# EAGLE design 130801_AriloRX_0_0 (EAGLE 6.1)
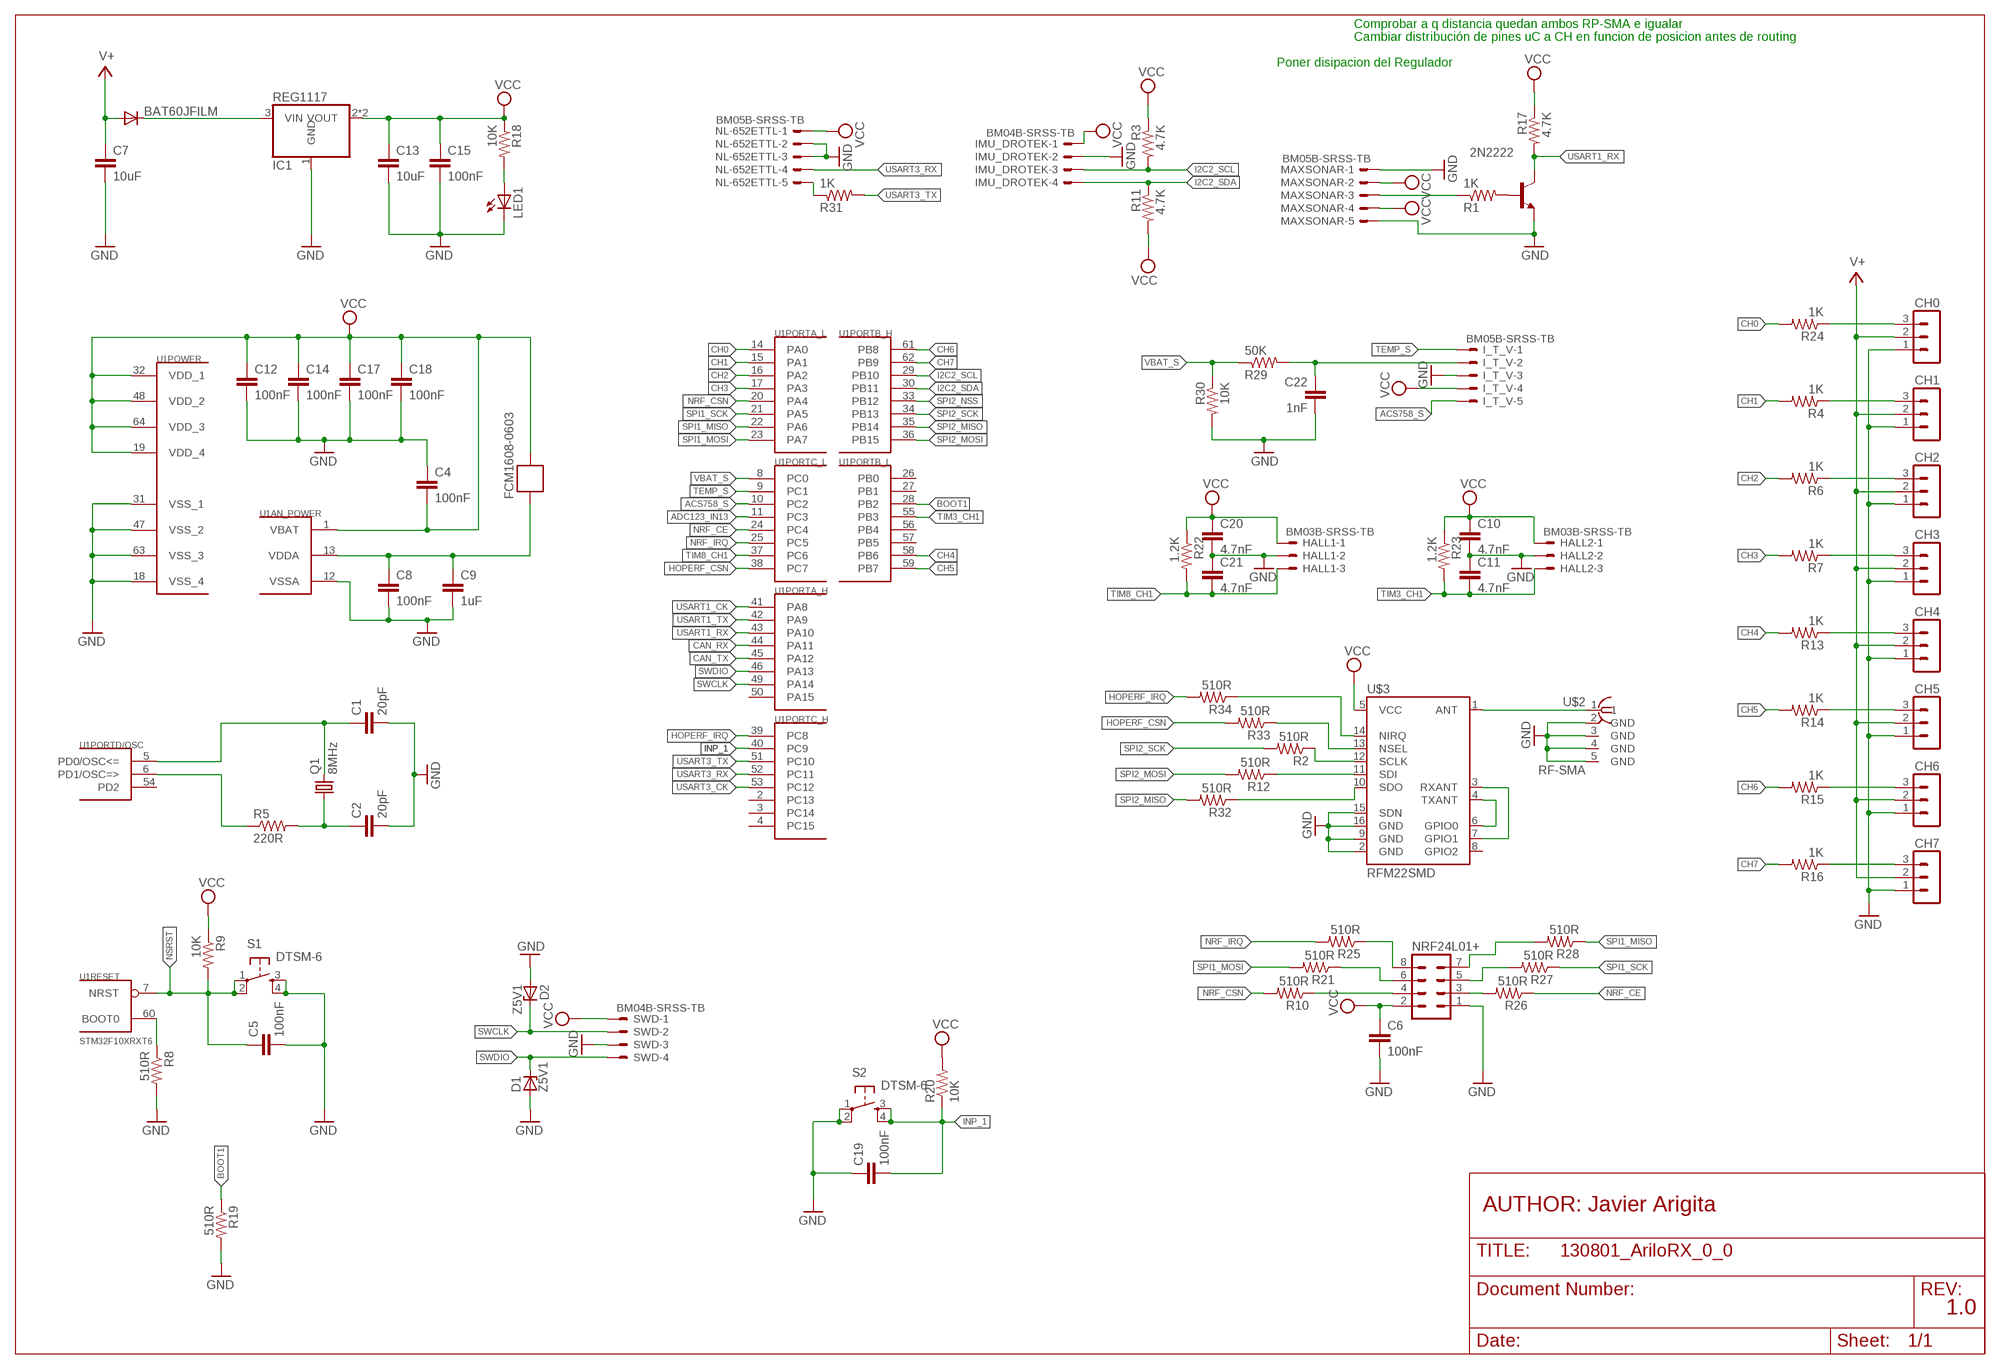
[diagram p0: schematic, sheet 1]

## Parts
2N2222  MMBT2222ALT1-NPN-SOT23-BEC  [SOT23-BEC]
BAT60JFILM  DIODE-SOD323-R  [SOD323-R]
C1  20pF  C-EUC0805  [C0805]
C2  20pF  C-EUC0805  [C0805]
C4  100nF  C-EUC0805  [C0805]
C5  100nF  C-EUC0805  [C0805]
C6  100nF  C-EUC0805  [C0805]
C7  10uF  C-EUC3216  [C3216]
C8  100nF  C-EUC0805  [C0805]
C9  1uF  C-EUC3216  [C3216]
C10  4.7nF  C-EUC0805  [C0805]
C11  4.7nF  C-EUC0805  [C0805]
C12  100nF  C-EUC0805  [C0805]
C13  10uF  C-EUC3216  [C3216]
C14  100nF  C-EUC0805  [C0805]
C15  100nF  C-EUC0805  [C0805]
C17  100nF  C-EUC0805  [C0805]
C18  100nF  C-EUC0805  [C0805]
C19  100nF  C-EUC0805  [C0805]
C20  4.7nF  C-EUC0805  [C0805]
C21  4.7nF  C-EUC0805  [C0805]
C22  1nF  C-EUC0805  [C0805]
CH0  MA03-1  [MA03-1]
CH1  MA03-1  [MA03-1]
CH2  MA03-1  [MA03-1]
CH3  MA03-1  [MA03-1]
CH4  MA03-1  [MA03-1]
CH5  MA03-1  [MA03-1]
CH6  MA03-1  [MA03-1]
CH7  MA03-1  [MA03-1]
D1  Z5V1  ZENER-DIODESOD80C  [SOD80C]
D2  Z5V1  ZENER-DIODESOD80C  [SOD80C]
FCM1608-0603  FERRITE-BEAD  [R0603]
HALL1  BM03B-SRSS-TB  [BM03B-SRSS-TB]
HALL2  BM03B-SRSS-TB  [BM03B-SRSS-TB]
I_T_V  BM05B-SRSS-TB  [BM05B-SRSS-TB]
IC1  REG1117  [SOT223]
IMU_DROTEK  BM04B-SRSS-TB  [BM04B-SRSS-TB]
LED1  LED0805  [CHIPLED_0805]
MAXSONAR  BM05B-SRSS-TB  [BM05B-SRSS-TB]
NL-652ETTL  BM05B-SRSS-TB  [BM05B-SRSS-TB]
NRF24L01+  MA04-2  [MA04-2]
Q1  8MHz  CRYSTALSM49  [SM49]
R1  1K  RESISTOR0805  [R0805]
R2  510R  RESISTOR0805  [R0805]
R3  4.7K  RESISTOR0805  [R0805]
R4  1K  RESISTOR0805  [R0805]
R5  220R  RESISTOR0805  [R0805]
R6  1K  RESISTOR0805  [R0805]
R7  1K  RESISTOR0805  [R0805]
R8  510R  RESISTOR0805  [R0805]
R9  10K  RESISTOR0805  [R0805]
R10  510R  RESISTOR0805  [R0805]
R11  4.7K  RESISTOR0805  [R0805]
R12  510R  RESISTOR0805  [R0805]
R13  1K  RESISTOR0805  [R0805]
R14  1K  RESISTOR0805  [R0805]
R15  1K  RESISTOR0805  [R0805]
R16  1K  RESISTOR0805  [R0805]
R17  4.7K  RESISTOR0805  [R0805]
R18  10K  RESISTOR0805  [R0805]
R19  510R  RESISTOR0805  [R0805]
R20  10K  RESISTOR0805  [R0805]
R21  510R  RESISTOR0805  [R0805]
R22  1.2K  RESISTOR0805  [R0805]
R23  1.2K  RESISTOR0805  [R0805]
R24  1K  RESISTOR0805  [R0805]
R25  510R  RESISTOR0805  [R0805]
R26  510R  RESISTOR0805  [R0805]
R27  510R  RESISTOR0805  [R0805]
R28  510R  RESISTOR0805  [R0805]
R29  50K  RESISTOR0805  [R0805]
R30  10K  RESISTOR0805  [R0805]
R31  1K  RESISTOR0805  [R0805]
R32  510R  RESISTOR0805  [R0805]
R33  510R  RESISTOR0805  [R0805]
R34  510R  RESISTOR0805  [R0805]
S1  DTSM-6  [DTSM-6]
S2  DTSM-6  [DTSM-6]
SWD  BM04B-SRSS-TB  [BM04B-SRSS-TB]
U1  STM32F10XRXT6  [TQFP64]
U$2  RF-SMA  [BU-SMA-H]
U$3  RFM22SMD  [RFM22-XXX-S2]

## Nets
ACS758_S: I_T_V.5 U1.10(PORTC_L:PC2)
ADC123_IN13: U1.11(PORTC_L:PC3)
BOOT1: R19.1 U1.28(PORTB_L:PB2)
CAN_RX: U1.44(PORTA_H:PA11)
CAN_TX: U1.45(PORTA_H:PA12)
CH0: R24.2 U1.14(PORTA_L:PA0)
CH1: R4.2 U1.15(PORTA_L:PA1)
CH2: R6.2 U1.16(PORTA_L:PA2)
CH3: R7.2 U1.17(PORTA_L:PA3)
CH4: R13.2 U1.58(PORTB_L:PB6)
CH5: R14.2 U1.59(PORTB_L:PB7)
CH6: R15.2 U1.61(PORTB_H:PB8)
CH7: R16.2 U1.62(PORTB_H:PB9)
GND: 2N2222.E C1.2 C2.2 C4.1 C5.2 C6.2 C7.2 C8.2 C9.2 C10.2 C11.1 C12.2 C13.2 C14.2 C15.2 C17.2 C18.2 C19.1 C20.2 C21.1 C22.2 CH0.1 CH1.1 CH2.1 CH3.1 CH4.1 CH5.1 CH6.1 CH7.1 D1.A D2.A HALL1.2 HALL2.2 I_T_V.3 IC1.1(GND) IMU_DROTEK.2 LED1.C MAXSONAR.1 MAXSONAR.5 NL-652ETTL.2 NL-652ETTL.3 NRF24L01+.1 R8.2 R19.2 R30.2 S1.3 S1.4 S2.1 S2.2 SWD.3 U1.12(AN_POWER:VSSA) U1.18(POWER:VSS_4) U1.31(POWER:VSS_1) U1.47(POWER:VSS_2) U1.63(POWER:VSS_3) U$2.2(GND) U$2.3(GND) U$2.4(GND) U$2.5(GND) U$3.2(GND) U$3.9(GND) U$3.15(SDN) U$3.16(GND)
HOPERF_CSN: R33.2 U1.38(PORTC_L:PC7)
HOPERF_IRQ: R34.2 U1.39(PORTC_H:PC8)
I2C2_SCL: IMU_DROTEK.3 R3.2 U1.29(PORTB_H:PB10)
I2C2_SDA: IMU_DROTEK.4 R11.1 U1.30(PORTB_H:PB11)
INP_1: C19.2 R20.1 S2.3 S2.4 U1.40(PORTC_H:PC9)
N$1: C1.1 Q1.2 U1.5(PORTD/OSC:PD0/OSC<=)
N$2: R5.1 U1.6(PORTD/OSC:PD1/OSC=>)
N$3: C2.1 Q1.1 R5.2
N$4: R8.1 U1.60(RESET:BOOT0)
N$5: U$3.3(RXANT) U$3.7(GPIO1)
N$6: U$3.4(TXANT) U$3.6(GPIO0)
N$7: R2.1 U$3.12(SCLK)
N$8: R12.1 U$3.11(SDI)
N$9: CH0.3 R24.1
N$10: LED1.A R18.2
N$11: NL-652ETTL.5 R31.1
N$12: R32.1 U$3.10(SDO)
N$13: BAT60JFILM.C IC1.3(VIN)
N$14: MAXSONAR.3 R1.1
N$15: C22.1 I_T_V.2 R29.2
N$16: 2N2222.B R1.2
N$17: C8.1 C9.1 FCM1608-0603.2 U1.13(AN_POWER:VDDA)
N$18: NRF24L01+.4 R10.1
N$19: NRF24L01+.3 R26.2
N$20: U$2.1 U$3.1(ANT)
N$21: CH2.3 R6.1
N$22: R34.1 U$3.14(NIRQ)
N$23: CH4.3 R13.1
N$24: R33.1 U$3.13(NSEL)
N$31: CH3.3 R7.1
N$32: CH6.3 R15.1
N$34: CH5.3 R14.1
N$35: CH7.3 R16.1
N$36: NRF24L01+.5 R27.2
N$38: NRF24L01+.6 R21.1
N$39: NRF24L01+.8 R25.1
N$42: NRF24L01+.7 R28.2
N$53: CH1.3 R4.1
NRF_CE: R26.1 U1.24(PORTC_L:PC4)
NRF_CSN: R10.2 U1.20(PORTA_L:PA4)
NRF_IRQ: R25.2 U1.25(PORTC_L:PC5)
NSRST: C5.1 R9.2 S1.1 S1.2 U1.7(RESET:NRST)
SPI1_MISO: R28.1 U1.22(PORTA_L:PA6)
SPI1_MOSI: R21.2 U1.23(PORTA_L:PA7)
SPI1_SCK: R27.1 U1.21(PORTA_L:PA5)
SPI2_MISO: R32.2 U1.35(PORTB_H:PB14)
SPI2_MOSI: R12.2 U1.36(PORTB_H:PB15)
SPI2_NSS: U1.33(PORTB_H:PB12)
SPI2_SCK: R2.2 U1.34(PORTB_H:PB13)
SWCLK: D2.C SWD.2 U1.49(PORTA_H:PA14)
SWDIO: D1.C SWD.4 U1.46(PORTA_H:PA13)
TEMP_S: I_T_V.1 U1.9(PORTC_L:PC1)
TIM3_CH1: C11.2 HALL2.3 R23.2 U1.55(PORTB_L:PB3)
TIM8_CH1: C21.2 HALL1.3 R22.2 U1.37(PORTC_L:PC6)
USART1_CK: U1.41(PORTA_H:PA8)
USART1_RX: 2N2222.C R17.2 U1.43(PORTA_H:PA10)
USART1_TX: U1.42(PORTA_H:PA9)
USART3_CK: U1.53(PORTC_H:PC12)
USART3_RX: NL-652ETTL.4 U1.52(PORTC_H:PC11)
USART3_TX: R31.2 U1.51(PORTC_H:PC10)
V+: BAT60JFILM.A C7.1 CH0.2 CH1.2 CH2.2 CH3.2 CH4.2 CH5.2 CH6.2 CH7.2
VBAT_S: R29.1 R30.1 U1.8(PORTC_L:PC0)
VCC: C4.2 C6.1 C10.1 C12.1 C13.1 C14.1 C15.1 C17.1 C18.1 C20.1 FCM1608-0603.1 HALL1.1 HALL2.1 I_T_V.4 IC1.2(VOUT) IC1.4(VOUT) IMU_DROTEK.1 MAXSONAR.2 MAXSONAR.4 NL-652ETTL.1 NRF24L01+.2 R3.1 R9.1 R11.2 R17.1 R18.1 R20.2 R22.1 R23.1 SWD.1 U1.1(AN_POWER:VBAT) U1.19(POWER:VDD_4) U1.32(POWER:VDD_1) U1.48(POWER:VDD_2) U1.64(POWER:VDD_3) U$3.5(VCC)
Unconnected: U1.2(PORTC_H:PC13) U1.3(PORTC_H:PC14) U1.4(PORTC_H:PC15) U1.26(PORTB_L:PB0) U1.27(PORTB_L:PB1) U1.50(PORTA_H:PA15) U1.54(PORTD/OSC:PD2) U1.56(PORTB_L:PB4) U1.57(PORTB_L:PB5) U$3.8(GPIO2)

## Notes on the sheet
- Comprobar a q distancia quedan ambos RP-SMA e igualar
- Cambiar distribución de pines uC a CH en funcion de posicion antes de routing
- Poner disipacion del Regulador
- AUTHOR: Javier Arigita
- 1.0

## Library data of the parts
2N2222 = transistor:*-NPN-: NPN Transistror BF959 corrected 2008.03.06
BAT60JFILM = diode:DIODE-: DIODE
C1 C2 C4-C6 C8 C10-C12 C14 C15 C17-C22 = rcl:C-EU: CAPACITOR, European symbol
C7 C9 C13 = resistor:C-EU: CAPACITOR, European symbol
CH0 CH1-CH7 = con-lstb:MA03-1: PIN HEADER; OC_FARNELL: unknown; OC_NEWARK: unknown
D1 D2 = diode:ZENER-DIODE: Z-Diode
FCM1608-0603 = BaseApp:FERRITE-BEAD
HALL1 HALL2 = con-jst2:?M03B-SRSS-TB: Disconnectable Crimp style connector, 1.0mm pitch 3 contacts
I_T_V MAXSONAR NL-652ETTL = con-jst2:?M05B-SRSS-TB: Disconnectable Crimp style connector, 1.0mm pitch 5 contacts
IC1 = CEDT:REG1117: 800mA and 1A Low Dropout (LDO) Positive Regulator 1.8V, 2.5V, 2.85V, 3.3V, 5V, and Adj
IMU_DROTEK SWD = con-jst2:?M04B-SRSS-TB: Disconnectable Crimp style connector, 1.0mm pitch 4 contacts
LED1 = CEDT:LED
NRF24L01+ = con-lstb:MA04-2: PIN HEADER; OC_FARNELL: unknown; OC_NEWARK: unknown
Q1 = crystal:CRYSTAL: CRYSTAL; OC_FARNELL: unknown; OC_NEWARK: unknown
R1-R34 = CEDT:RESISTOR
S1 S2 = switch-tact:DTSM-6
U1 = stm32:STM32F10XRXT6: STM32F101/103 64pin LQFP
U$2 = BaseApp:RF-SMA
U$3 = SparkFun-RF:RFM22: The RFM22 is a low-power, low cost radio that is capable of operating in the 434MHz and 900MHz open bands. It's frequency is software defined and there are some very good libraries written for it.

## Board
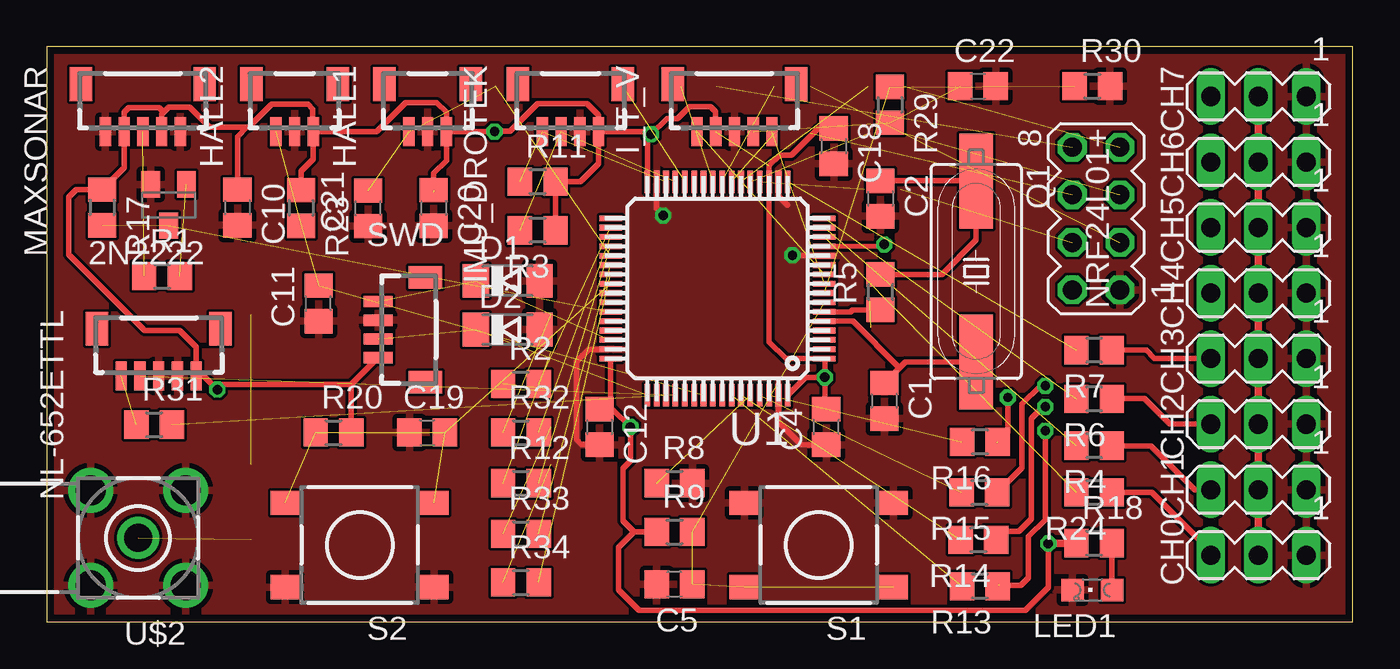
[diagram p1: board, top side]
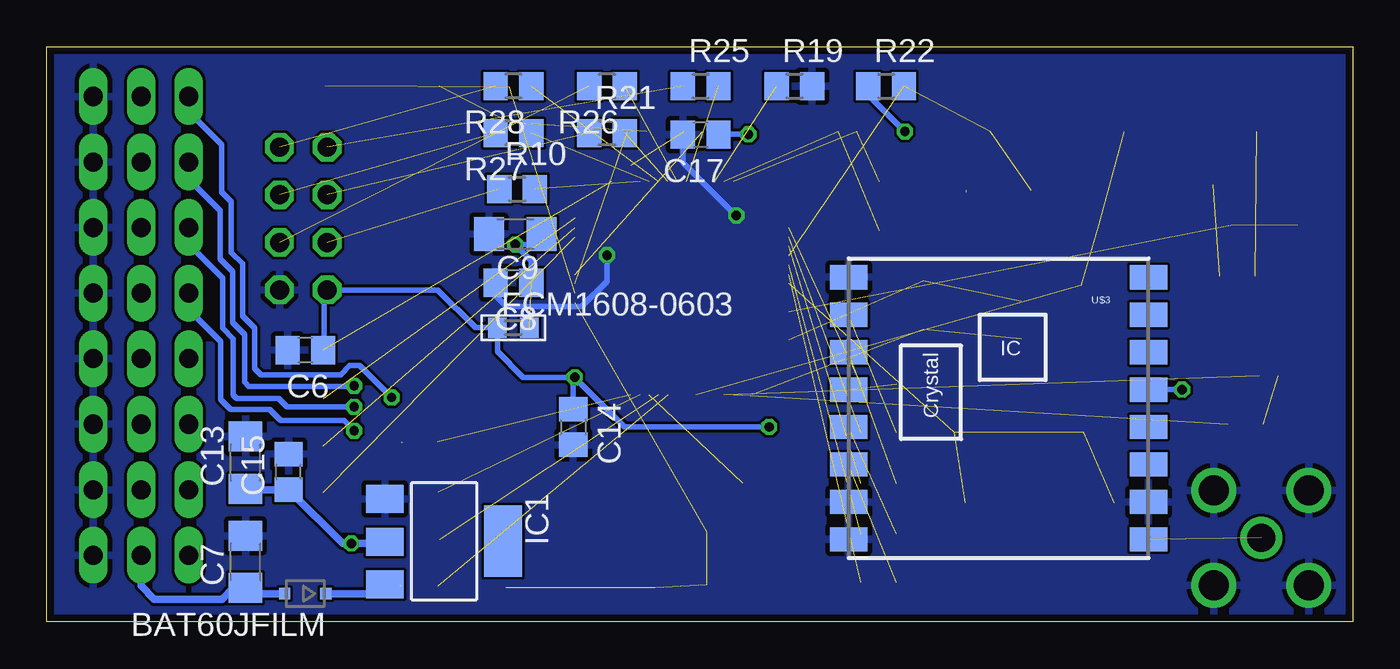
[diagram p2: board, bottom side, seen from below]

Size 69.7 x 30.7 mm. Coordinates in mm from the lower left corner, seen from the top.
Outline: 0,0 69.7,0 69.7,30.7 0,30.7 0,0
Copper layers (1*16): Top 0.0356mm / dielectric 1.5011mm / Bottom 0.0356mm
Design rules: minimum track width 6mil, minimum drill 13mil, track to track 6mil, track to pad 6mil, pad to pad 6mil, via to via 6mil, smd to smd 6mil, copper to edge 15mil, drill to drill 6mil, minimum pad ring 7mil, minimum via ring 7mil, stop-mask expansion 4mil, vias tented up to drill 0mil, thermal gap 10mil

### Footprints (pad centres in the part's own frame; a part is rotated, then mirrored left to right if it is on the bottom)
SOT23-BEC = smd 1 x 1.4: B -0.95,-1.1; C 0,1.1; E 0.95,-1.1
SOD323-R = smd 0.6 x 0.6: A 1.1,0; C -1.1,0
C0805 = smd 1.3 x 1.5: 1 -0.95,0; 2 0.95,0
C3216 = smd 1.6 x 1.8: 1 -1.4,0; 2 1.4,0
MA03-1 = drill 1.016 long: 1 -2.54,0; 2 0,0; 3 2.54,0
SOD80C = smd 1.4 x 1.8: A 1.7,0; C -1.7,0
R0603 = smd 1 x 1.1: 1 -0.85,0; 2 0.85,0
BM03B-SRSS-TB = smd 0.6 x 1.55: 1 1,-1.625; 2 0,-1.625; 3 -1,-1.625 | smd 1.2 x 1.8: FIT@1 2.3,0.9; FIT@2 -2.3,0.9
BM05B-SRSS-TB = smd 0.6 x 1.55: 1 2,-1.625; 2 1,-1.625; 3 0,-1.625; 4 -1,-1.625; 5 -2,-1.625 | smd 1.2 x 1.8: FIT@1 3.3,0.9; FIT@2 -3.3,0.9
SOT223 = smd 1.499 x 2.007: 1 -2.261,-3.15; 2 0.025,-3.15; 3 2.311,-3.15 | smd 3.81 x 2.007: 4 0,3.15
BM04B-SRSS-TB = smd 0.6 x 1.55: 1 1.5,-1.625; 2 0.5,-1.625; 3 -0.5,-1.625; 4 -1.5,-1.625 | smd 1.2 x 1.8: FIT@1 2.8,0.9; FIT@2 -2.8,0.9
CHIPLED_0805 = smd 1.2 x 1.2: A 0,-1.05; C 0,1.05
MA04-2 = drill 1.016 octagon: 1 -3.81,-1.27; 2 -3.81,1.27; 3 -1.27,-1.27; 4 -1.27,1.27; 5 1.27,-1.27; 6 1.27,1.27; 7 3.81,-1.27; 8 3.81,1.27
SM49 = smd 5.08 x 1.778: 1 -4.826,0; 2 4.826,0
R0805 = smd 1.3 x 1.5: 1 -0.95,0; 2 0.95,0
DTSM-6 = smd 1.55 x 1.3: 1 -3.975,2.25; 2 3.975,2.25; 3 -3.975,-2.25; 4 3.975,-2.25
TQFP64 = smd 1.2 x 0.3: 1 -5.7,3.75; 2 -5.7,3.25; 3 -5.7,2.75; 4 -5.7,2.25; 5 -5.7,1.75; 6 -5.7,1.25; 7 -5.7,0.75; 8 -5.7,0.25; 9 -5.7,-0.25; 10 -5.7,-0.75; 11 -5.7,-1.25; 12 -5.7,-1.75; 13 -5.7,-2.25; 14 -5.7,-2.75; 15 -5.7,-3.25; 16 -5.7,-3.75; 33 5.7,-3.75; 34 5.7,-3.25; 35 5.7,-2.75; 36 5.7,-2.25; 37 5.7,-1.75; 38 5.7,-1.25; 39 5.7,-0.75; 40 5.7,-0.25; 41 5.7,0.25; 42 5.7,0.75; 43 5.7,1.25; 44 5.7,1.75; 45 5.7,2.25; 46 5.7,2.75; 47 5.7,3.25; 48 5.7,3.75 | smd 0.3 x 1.2: 17 -3.75,-5.7; 18 -3.25,-5.7; 19 -2.75,-5.7; 20 -2.25,-5.7; 21 -1.75,-5.7; 22 -1.25,-5.7; 23 -0.75,-5.7; 24 -0.25,-5.7; 25 0.25,-5.7; 26 0.75,-5.7; 27 1.25,-5.7; 28 1.75,-5.7; 29 2.25,-5.7; 30 2.75,-5.7; 31 3.25,-5.7; 32 3.75,-5.7; 49 3.75,5.7; 50 3.25,5.7; 51 2.75,5.7; 52 2.25,5.7; 53 1.75,5.7; 54 1.25,5.7; 55 0.75,5.7; 56 0.25,5.7; 57 -0.25,5.7; 58 -0.75,5.7; 59 -1.25,5.7; 60 -1.75,5.7; 61 -2.25,5.7; 62 -2.75,5.7; 63 -3.25,5.7; 64 -3.75,5.7
BU-SMA-H = drill 1.5: 1 0,0 | drill 1.6: 2 -2.54,2.54; 3 2.54,2.54; 4 2.54,-2.54; 5 -2.54,-2.54
RFM22-XXX-S2 = smd 2 x 1.3: 1 -8,7; 2 -8,5; 3 -8,3; 4 -8,1; 5 -8,-1; 6 -8,-3; 7 -8,-5; 8 -8,-7; 9 8,-7; 10 8,-5; 11 8,-3; 12 8,-1; 13 8,1; 14 8,3; 15 8,5; 16 8,7

### Placement (x,y rotation side)
2N2222  6.5,22.25 180 top
BAT60JFILM  55.9,1.5 180 bottom
C1  44.7,11.8 270 top
C2  44.5,22.6 270 top
C4  41.6,10.4 90 top
C5  33.5,2 180 top
C6  55.9,14.5 180 bottom
C7  59.1,3.2 90 bottom
C8  44.8,18.1 180 bottom
C9  44.7,20.7 180 bottom
C10  10.18,22.12 270 top
C11  14.5,17 90 top
C12  29.5,10.4 270 top
C13  59.1,8.5 90 bottom
C14  41.6,10.4 270 bottom
C15  56.8,8 90 bottom
C17  34.8,26 180 bottom
C18  42,25.4 270 top
C19  20.3,10.1 0 top
C20  20.65,22.1 270 top
C21  17.15,22.07 90 top
C22  49.7,28.6 0 top
CH0  64.67,3.55 180 top
CH1  64.67,7.05 180 top
CH2  64.67,10.55 180 top
CH3  64.67,14.05 180 top
CH4  64.67,17.55 180 top
CH5  64.67,21.05 180 top
CH6  64.67,24.55 180 top
CH7  64.67,28.05 180 top
D1  24.6,18.2 0 top
D2  24.6,15.6 0 top
FCM1608-0603  44.8,15.7 0 bottom
HALL1  20.32,27.8 0 top
HALL2  13.22,27.8 0 top
I_T_V  36.7,27.8 0 top
IC1  48.5,4.3 270 bottom
IMU_DROTEK  27.95,27.8 0 top
LED1  55.8,1.7 90 top
MAXSONAR  5.12,27.8 0 top
NL-652ETTL  5.97,14.75 0 top
NRF24L01+  56.01,21.53 90 top
Q1  49.6,18.7 270 top
R1  6.15,18.45 0 top
R2  25.3,12.7 0 top
R3  26.2,20.9 180 top
R4  55.9,9.4 180 top
R5  44.5,17.6 90 top
R6  55.9,11.9 180 top
R7  55.9,14.5 180 top
R8  33.5,7.4 0 top
R9  33.5,4.8 0 top
R10  44.6,23.1 0 bottom
R11  26.2,23.5 0 top
R12  25.3,7.4 0 top
R13  49.8,1.9 180 top
R14  49.73,4.38 180 top
R15  49.78,6.9 180 top
R16  49.8,9.6 180 top
R17  2.95,22.12 270 top
R18  55.9,4.2 0 top
R19  29.8,28.6 0 bottom
R20  15.3,10.1 0 top
R21  39.8,26.1 0 bottom
R22  24.9,28.6 0 bottom
R23  13.57,22.1 270 top
R24  55.9,6.9 180 top
R25  34.8,28.6 0 bottom
R26  39.8,28.6 180 bottom
R27  44.8,26.1 180 bottom
R28  44.8,28.6 180 bottom
R29  45,27.6 270 top
R30  55.8,28.6 0 top
R31  5.72,10.53 0 top
R32  25.3,10.1 0 top
R33  25.3,4.7 0 top
R34  25.3,2.1 0 top
S1  41.2,4.1 180 top
S2  16.7,4.1 180 top
SWD  19.3,15.6 270 top
U1  35.8,17.8 180 top
U$2  4.87,4.47 180 top
U$3  18.9,11.4 180 bottom

### Tracks (layer width: path | path; a pad name or v marks a point on that pad's centre or on a via)
ACS758_S  (1 unrouted)
BOOT1  (1 unrouted)
CH0  (1 unrouted)
CH1  (1 unrouted)
CH2  (1 unrouted)
CH3  (1 unrouted)
CH4  (1 unrouted)
CH5  (1 unrouted)
CH6  (1 unrouted)
CH7  (1 unrouted)
GND  (via drill 0.5 pad 0.25)
  Top 0.305: U1.18 39.05,22.73 39.53,22.25 | U1.12 39.83,19.55 v39.8,19.57 | U1.63 39.05,10.68 40.28,9.45 C4.1 | U1.47 28.93,14.55 28.28,13.9 28.28,9.72 28.53,9.47 29.55,9.47 29.57,9.5 | U1.31 32.55,22.05 v32.9,21.7
  Bottom 0.305: v39.8,19.57 39.8,18.18 41.15,16.82 45.15,16.82 45.75,17.43 C8.2 | v32.9,21.7 32.92,21.7 35.75,24.52 C17.2
  pour Top: 0.5,30.2 69.2,30.2 69.2,0.5 0.5,0.5
  pour Bottom: 0.5,30.2 69.2,30.2 69.2,0.5 0.5,0.5
HOPERF_CSN  (1 unrouted)
HOPERF_IRQ  (1 unrouted)
I2C2_SCL  (2 unrouted)
I2C2_SDA  (2 unrouted)
INP_1  (4 unrouted)
N$1
  Top 0.305: Q1.2 45.82,13.87 45.51,13.56 | 45.51,13.56 C1.1 | U1.5 43.03,16.05 45.51,13.56
N$2
  Top 0.305: R5.1 43,16.65 42.9,16.55 U1.6
N$3
  Top 0.305: R5.2 47.78,18.55 49.6,20.38 49.6,22.77 | 49.6,22.77 Q1.1 | C2.1 48.83,23.55 49.6,22.77
N$4  (1 unrouted)
N$5  (1 unrouted)
N$6  (1 unrouted)
N$7  (1 unrouted)
N$8  (1 unrouted)
N$9
  Top 0.305: CH0.3 62.14,3.77 58.98,6.9 R24.1
N$10
  Top 0.305: R18.2 LED1.A
N$11  (1 unrouted)
N$12  (1 unrouted)
N$13
  Bottom 0.406: IC1.3 52.14,1.5 BAT60JFILM.C
N$14  (1 unrouted)
N$15  (2 unrouted)
N$16  (1 unrouted)
N$17  (via drill 0.5 pad 0.25)  (1 unrouted)
  Top 0.305: U1.13 44.48,20.02 v44.7,20.15
  Bottom 0.305: C9.1 43.85,20.15 v44.7,20.15 43.85,19.3 C8.1
N$18  (1 unrouted)
N$19  (1 unrouted)
N$20  (1 unrouted)
N$21
  Top 0.305: CH2.3 59.95,10.55 58.58,11.93 56.88,11.93 R6.1
N$22  (1 unrouted)
N$23  (via drill 0.5 pad 0.25)  (1 unrouted)
  Top 0.305: 50.8,1.95 R13.1 | v53.3,10.2 53.3,5.45 52.4,4.55 52.4,2.35 52,1.95 50.85,1.95 50.83,1.98
  Bottom 0.305: CH4.3 62.14,16.68 60.42,14.97 60.42,11.88 59.88,11.32 57.8,11.32 57.23,10.75 53.83,10.75 v53.3,10.2
N$24  (1 unrouted)
N$31
  Top 0.305: CH3.3 59.12,14.05 58.67,14.5 R7.1
N$32  (via drill 0.5 pad 0.25)
  Top 0.305: v53.3,12.6 53.03,12.6 52.05,11.62 52.05,8.22 R15.1
  Bottom 0.305: CH6.3 62.14,23.64 60.45,21.95 60.45,19.38 59.78,18.7 59.78,15.97 59.15,15.35 59.15,12.8 58.92,12.57 53.33,12.57 v53.3,12.6
N$34  (via drill 0.5 pad 0.25)
  Top 0.305: v53.3,11.47 53.17,11.47 52.55,10.85 52.55,5.5 51.88,4.83 51.12,4.83 R14.1
  Bottom 0.305: CH5.3 62.14,20.16 60.33,18.35 60.33,15.68 59.75,15.1 59.75,12.1 59.58,11.93 57.33,11.93 56.88,11.47 v53.3,11.47
N$35  (via drill 0.5 pad 0.25)  (1 unrouted)
  Top 0.305: v51.3,11.97 51.3,10.12 50.73,9.55
  Bottom 0.305: CH7.3 62.14,27.23 60.38,25.48 60.38,22.95 59.85,22.43 59.85,19.73 59.25,19.12 59.25,16.32 58.6,15.68 58.6,13.53 58.25,13.18 54.03,13.18 53.53,13.68 53,13.68 v51.3,11.97
N$36  (1 unrouted)
N$38  (1 unrouted)
N$39  (1 unrouted)
N$42  (1 unrouted)
N$53
  Top 0.305: CH1.3 61.28,7.05 58.92,9.4 R4.1
NRF_CE  (1 unrouted)
NRF_CSN  (1 unrouted)
NRF_IRQ  (1 unrouted)
NSRST  (4 unrouted)
SPI1_MISO  (1 unrouted)
SPI1_MOSI  (1 unrouted)
SPI1_SCK  (1 unrouted)
SPI2_MISO  (1 unrouted)
SPI2_MOSI  (1 unrouted)
SPI2_SCK  (1 unrouted)
SWCLK  (2 unrouted)
SWDIO  (2 unrouted)
TEMP_S  (1 unrouted)
TIM3_CH1  (3 unrouted)
TIM8_CH1  (3 unrouted)
USART1_RX  (2 unrouted)
USART3_RX  (1 unrouted)
USART3_TX  (1 unrouted)
V+
  Top 0.406: CH7.2 CH6.2 CH5.2 CH4.2 CH3.2 CH2.2 CH1.2 CH0.2
  Bottom 0.406: CH0.2 64.65,3.52 64.65,1.93 63.98,1.2 60.35,1.2 59.75,1.8 C7.1 58.8,1.5 BAT60JFILM.A
VBAT_S  (2 unrouted)
VCC  (via drill 0.5 pad 0.25)  (3 unrouted)
  Top 0.305: v41.53,13.05 41.53,14.03 U1.1 39.45,14.05 38.55,14.95 U1.19 38.55,24.35 39.12,24.93 39.75,24.93 41.17,26.35 C18.1 | U1.64 40.5,13.05 v41.53,13.05 | C4.2 41.53,11.43 v41.53,13.05 | U1.48 30.1,11.95 C12.1 30.2,11.35 v31.15,10.4 31.15,8.6 30.75,8.2 30.75,5.4 31.35,4.8 | U1.32 32.05,25.82 v32.25,26.02 | I_T_V.4 35.7,27.23 35.42,27.5 34.3,27.5 33.67,26.88 33.1,26.88 v32.25,26.02 | IMU_DROTEK.1 32.1,26.18 v32.25,26.02 | v23.9,26.18 HALL1.1 | HALL1.1 23.85,26.18 23.87,26.2 24.72,26.2 26.2,27.68 28.82,27.68 29.45,27.05 IMU_DROTEK.1 | IMU_DROTEK.1 29.45,24.45 28.5,23.5 R11.2 R3.1 | HALL1.1 21.32,24.62 20.65,23.95 20.65,22.95 | HALL2.1 17.6,26.18 19.15,27.73 20.8,27.73 21.32,27.2 HALL1.1 | HALL2.1 14.22,24.7 13.57,24.05 R23.1 13.6,23.02 | MAXSONAR.2 6.12,27.1 6.24,27.21 | 6.24,27.21 6.5,27.48 7.62,27.48 8.7,26.4 10.68,26.4 | 10.68,26.4 10.78,26.4 12,27.62 13.95,27.62 14.2,27.38 14.2,26.2 HALL2.1 | C10.1 10.18,25.9 10.68,26.4 | 6.24,27.21 6,27.45 4.37,27.45 4.12,27.2 MAXSONAR.4 4.12,24.25 R17.1 1.57,23.07 1.18,22.68 1.18,19.6 5.22,15.55 7.1,15.55 7.97,14.68 NL-652ETTL.1 8.37,13.12 v9.1,12.4 9.37,12.68 16.25,12.68 | 31.35,4.8 R9.1 | R20.2 16.25,12.68 | 16.25,12.68 SWD.1 | v53.45,4.17 53.45,1.85 52.23,0.62 31.6,0.62 30.53,1.7 30.53,3.98 31.35,4.8
  Top 0.406: R18.1 54.92,4.17 v53.45,4.17
  Bottom 0.305: v41.53,13.05 41.6,12.97 C4.2 | v41.53,13.05 44.28,13.05 45.65,14.43 FCM1608-0603.1 46.83,15.7 48.85,17.73 NRF24L01+.2 54.9,17.55 54.9,14.5 | v31.15,10.4 38.88,10.4 v41.53,13.05 | v32.25,26.02 33.83,26.02 C17.1 | R22.1 25.85,28.12 v23.9,26.18 | v9.1,12.4 U$3.5 | C15.1 53.9,4.15 53.48,4.15 v53.45,4.17
  Bottom 0.406: IC1.2 51.75,4.17 v53.45,4.17 53.92,4.17 C15.1 59.05,7.05 C13.1

### Text on the board
Bottom: AriloRX_v2